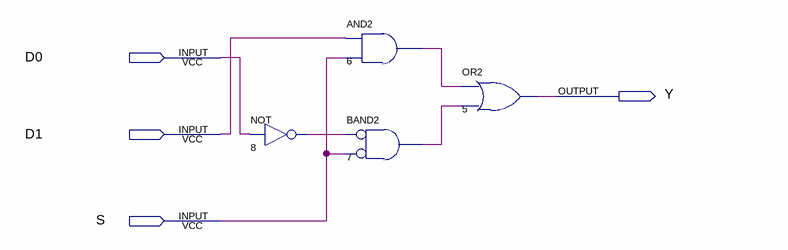
[diagram p0: schematic sheet]
// Quartus schematic 2-1Mux.bdf as structural Verilog: 4 symbols, 4 pins
module \2-1Mux  (
  input  D0,
  input  D1,
  input  S,
  output Y
);

  wire n6_out, n7_out, n8_out;

  not u_8 (n8_out, D0);
  and u_6 (n6_out, D1, S);
  and u_7 (n7_out, ~n8_out, ~S);  // BAND2
  or u_5 (Y, n6_out, n7_out);
endmodule
